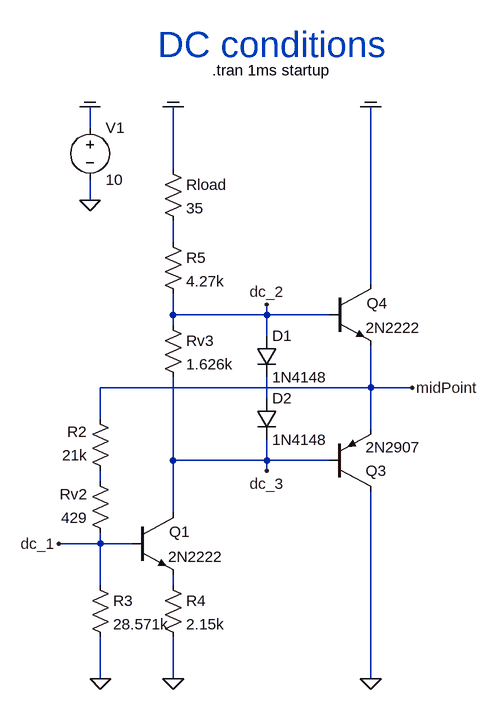
[diagram p0: schematic 2 stage amp with fb DC.asc]
2 stage amp with fb DC.asc, the LTspice schematic file:
Version 4
SHEET 1 940 696
WIRE 112 -192 112 -224
WIRE 240 -128 240 -224
WIRE 112 -80 112 -112
WIRE 240 -16 240 -48
WIRE 544 48 544 -224
WIRE 240 96 240 64
WIRE 384 96 384 80
WIRE 384 96 240 96
WIRE 480 96 384 96
WIRE 240 112 240 96
WIRE 384 128 384 96
WIRE 544 208 544 144
WIRE 544 208 128 208
WIRE 608 208 544 208
WIRE 384 224 384 192
WIRE 128 256 128 208
WIRE 544 272 544 208
WIRE 240 320 240 192
WIRE 384 320 384 288
WIRE 384 320 240 320
WIRE 480 320 384 320
WIRE 384 336 384 320
WIRE 128 352 128 336
WIRE 240 400 240 320
WIRE 128 448 128 432
WIRE 128 448 64 448
WIRE 176 448 128 448
WIRE 128 512 128 448
WIRE 240 512 240 496
WIRE 128 656 128 592
WIRE 240 656 240 592
WIRE 544 656 544 368
FLAG 112 -224 COM
FLAG 240 -224 COM
FLAG 544 -224 COM
FLAG 608 208 midPoint
FLAG 544 656 0
FLAG 240 656 0
FLAG 128 656 0
FLAG 384 80 dc_2
FLAG 384 336 dc_3
FLAG 64 448 dc_1
FLAG 112 -80 0
SYMBOL npn 176 400 R0
WINDOW 0 58 30 Left 2
SYMATTR InstName Q1
SYMATTR Value 2N2222
SYMBOL pnp 480 368 M180
SYMATTR InstName Q3
SYMATTR Value 2N2907
SYMBOL npn 480 48 R0
WINDOW 0 58 30 Left 2
SYMATTR InstName Q4
SYMATTR Value 2N2222
SYMBOL diode 368 128 R0
SYMATTR InstName D1
SYMATTR Value 1N4148
SYMBOL diode 368 224 R0
SYMATTR InstName D2
SYMATTR Value 1N4148
SYMBOL res 224 96 R0
SYMATTR InstName Rv3
SYMATTR Value 1.626k
SYMBOL res 224 -32 R0
SYMATTR InstName R5
SYMATTR Value 4.27k
SYMBOL res 224 -144 R0
SYMATTR InstName Rload
SYMATTR Value 35
SYMBOL res 224 496 R0
SYMATTR InstName R4
SYMATTR Value 2.15k
SYMBOL res 112 496 R0
SYMATTR InstName R3
SYMATTR Value 28.571k
SYMBOL res 144 448 R180
WINDOW 0 36 76 Left 2
WINDOW 3 36 40 Left 2
SYMATTR InstName Rv2
SYMATTR Value 429
SYMBOL res 144 352 R180
WINDOW 0 36 76 Left 2
WINDOW 3 36 40 Left 2
SYMATTR InstName R2
SYMATTR Value 21k
SYMBOL voltage 112 -208 R0
WINDOW 123 0 0 Left 2
WINDOW 39 0 0 Left 2
SYMATTR InstName V1
SYMATTR Value 10
TEXT 300 -280 Left 2 !.tran 1ms startup
TEXT 216 -320 Left 5 ;DC conditions

The netlist it stands for:
* 2 stage amp with fb DC.asc
Q1 dc_3 dc_1 N004 0 2N2222
Q3 0 dc_3 midPoint 0 2N2907
Q4 COM dc_2 midPoint 0 2N2222
D1 dc_2 N002 1N4148
D2 N002 dc_3 1N4148
Rv3 dc_2 dc_3 1.626k
R5 N001 dc_2 4.27k
Rload COM N001 35
R4 N004 0 2.15k
R3 dc_1 0 28.571k
Rv2 dc_1 N003 429
R2 N003 midPoint 21k
V1 COM 0 10
.model D D
.lib standard.dio
.model NPN NPN
.model PNP PNP
.lib standard.bjt
.tran 1ms startup
* DC conditions
.backanno
.end